# EAGLE design VSCard_v2 (EAGLE 8.3.1)
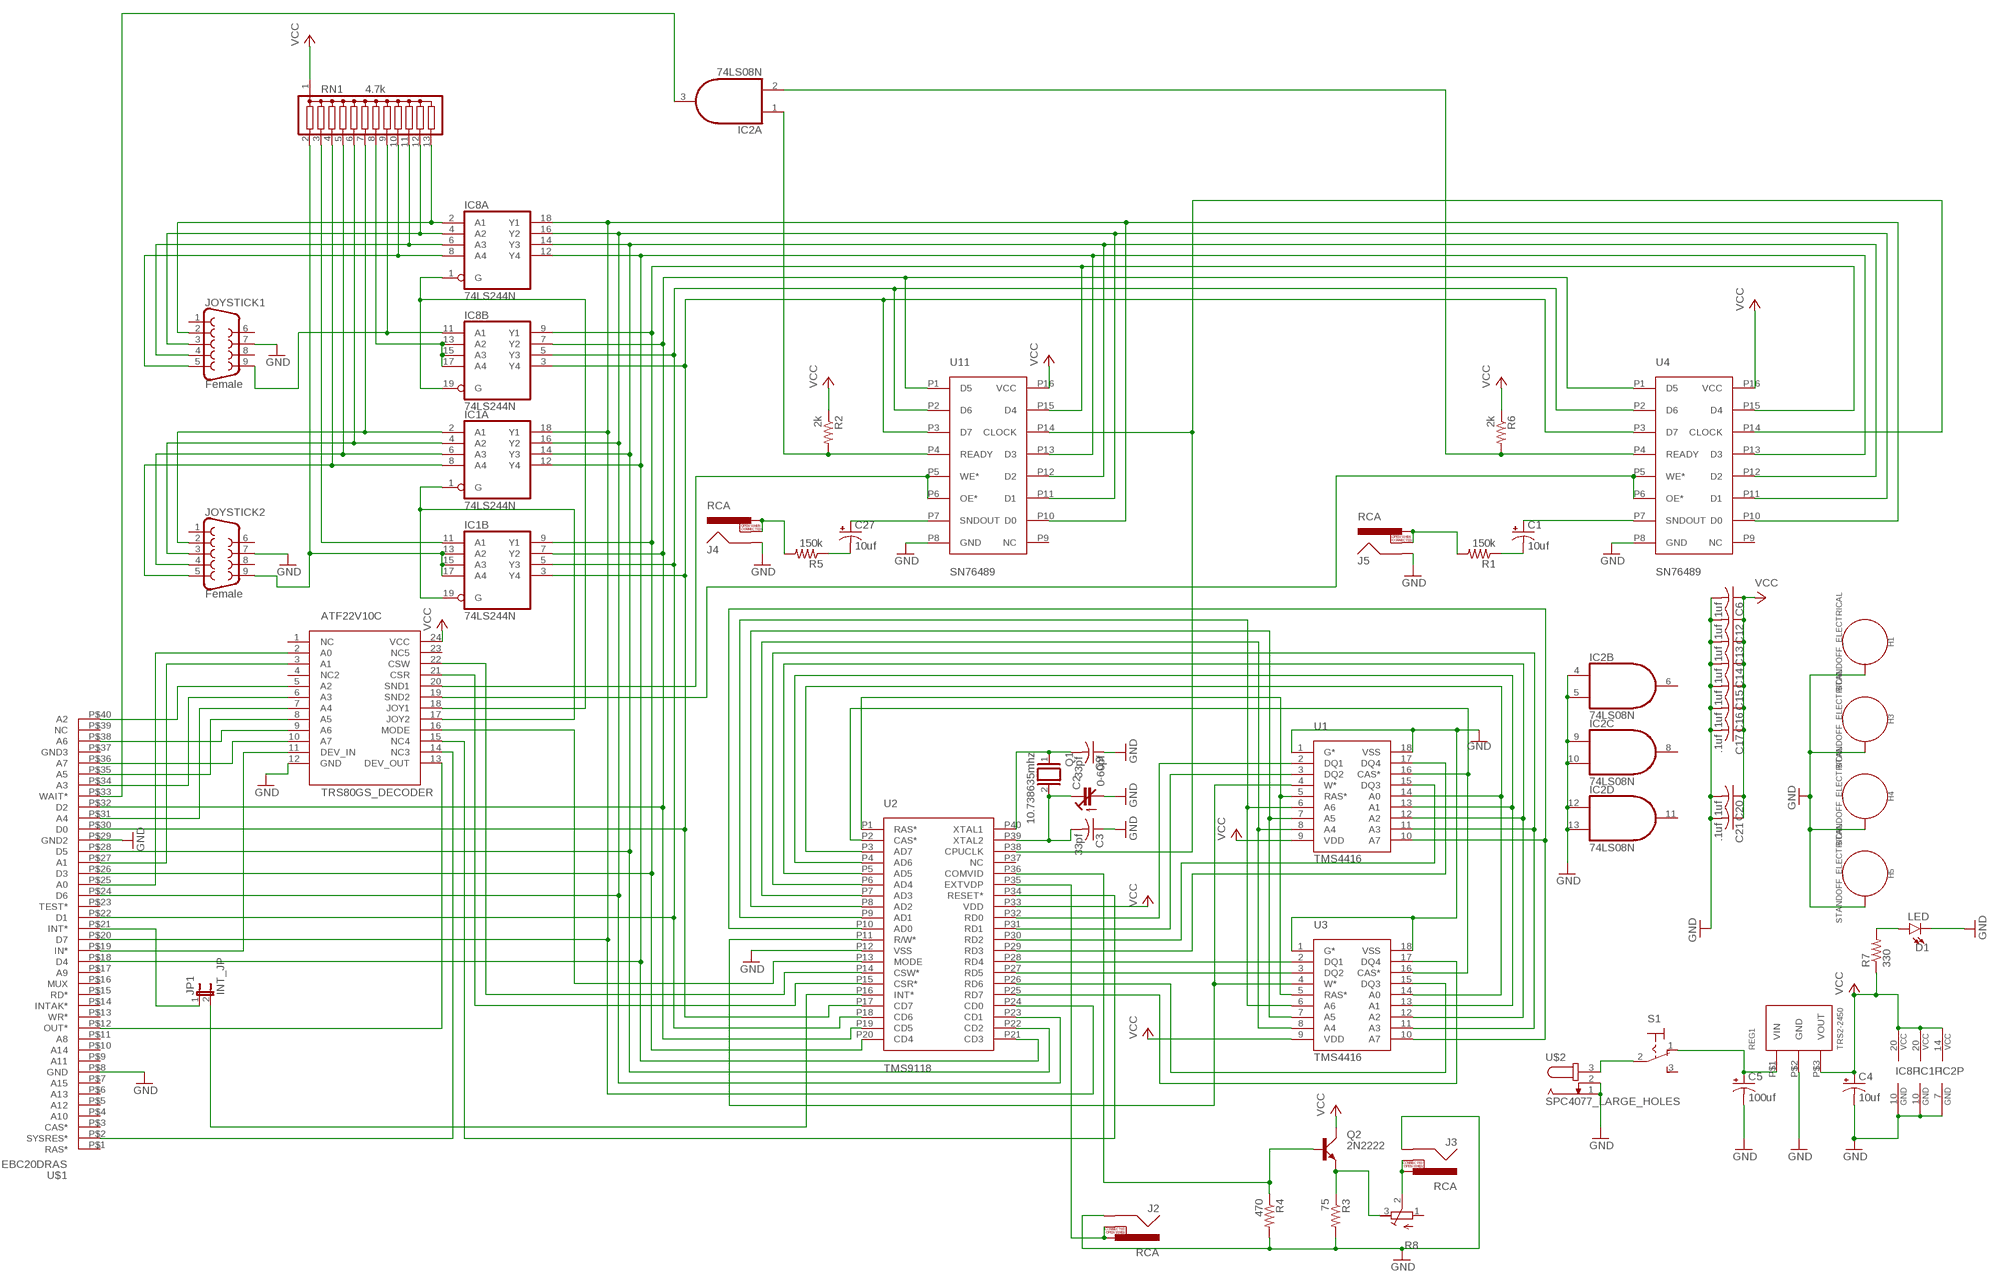
[diagram p0: schematic, sheet 1]

## Parts
ATF22V10C  TRS80GS_DECODER  [DIP24SKI]
C1  10uf  CPOL-USE2.5-6  [E2,5-6]
C2  0-60pf  C-TRIMM3050.504  [CTRIM3050.504]
C3  33pf  C-US050-050X075  [C050-050X075]
C4  10uf  CPOL-USE2.5-5  [E2,5-5]
C5  100uf  CPOL-USE3.5-10  [E3,5-10]
C6  .1uf  C-US025-025X050  [C025-025X050]
C9  33pf  C-US050-050X075  [C050-050X075]
C12  .1uf  C-US025-025X050  [C025-025X050]
C13  .1uf  C-US025-025X050  [C025-025X050]
C14  .1uf  C-US025-025X050  [C025-025X050]
C15  .1uf  C-US025-025X050  [C025-025X050]
C16  .1uf  C-US025-025X050  [C025-025X050]
C17  .1uf  C-US025-025X050  [C025-025X050]
C20  .1uf  C-US025-025X050  [C025-025X050]
C21  .1uf  C-US025-025X050  [C025-025X050]
C27  10uf  CPOL-USE2.5-6  [E2,5-6]
D1  LED  LED3MM  [LED_3MM]
H1  STANDOFF_ELECTRICAL  [STANDOFF-ELECTRICAL]
H3  STANDOFF_ELECTRICAL  [STANDOFF-ELECTRICAL]
H4  STANDOFF_ELECTRICAL  [STANDOFF-ELECTRICAL]
H5  STANDOFF_ELECTRICAL  [STANDOFF-ELECTRICAL]
IC1  74LS244N  [DIL20]
IC2  74LS08N  [DIL14]
IC8  74LS244N  [DIL20]
J2  RCA  [RCA]
J3  RCA  [RCA]
J4  RCA  [RCA]
J5  RCA  [RCA]
JOYSTICK1  Female  DB9FEMALE  [DB9]
JOYSTICK2  Female  DB9FEMALE  [DB9]
JP1  INT_JP  JP1E  [JP1]
Q1  10.738635mhz  XTAL/S  [QS]
Q2  2N2222  [TO18A]
R1  150k  R-US_0207/2V  [0207/2V]
R2  2k  R-US_0207/2V  [0207/2V]
R3  75  R-US_0207/2V  [0207/2V]
R4  470  R-US_0207/2V  [0207/2V]
R5  150k  R-US_0207/2V  [0207/2V]
R6  2k  R-US_0207/2V  [0207/2V]
R7  330  R-US_0309/V  [0309V]
R8  R-TRIMM64W  [RTRIM64W]
REG1  TRS2-2450  [TRACON_REG]
RN1  4.7k  G12R  [SIL13]
S1  320-916  [320-916]
U1  TMS4416  [DIP18]
U2  TMS9118  [DIP40_MCU]
U3  TMS4416  [DIP18]
U4  SN76489  [DIP16]
U11  SN76489  [DIP16]
U$1  EBC20DRAS  [EBC20DRAS]
U$2  SPC4077_LARGE_HOLES  [SPC4077]

## Nets
A0: ATF22V10C.2(A0) U$1.P$25(A0)
A1: ATF22V10C.3(A1) U$1.P$27(A1)
A2: ATF22V10C.5(A2) U$1.P$40(A2)
A3: ATF22V10C.6(A3) U$1.P$34(A3)
A4: ATF22V10C.7(A4) U$1.P$31(A4)
A5: ATF22V10C.8(A5) U$1.P$35(A5)
A6: ATF22V10C.9(A6) U$1.P$38(A6)
A7: ATF22V10C.10(A7) U$1.P$36(A7)
COMVID: Q2.B R4.1 U2.P36(COMVID)
COMVID-OUT: Q2.E R3.1 R8.3(E)
D0: IC1.3(B:Y4) IC8.3(B:Y4) U2.P17(CD7) U4.P3(D7) U11.P3(D7) U$1.P$30(D0)
D1: IC1.5(B:Y3) IC8.5(B:Y3) U2.P18(CD6) U4.P2(D6) U11.P2(D6) U$1.P$22(D1)
D2: IC1.7(B:Y2) IC8.7(B:Y2) U2.P19(CD5) U4.P1(D5) U11.P1(D5) U$1.P$32(D2)
D3: IC1.9(B:Y1) IC8.9(B:Y1) U2.P20(CD4) U4.P15(D4) U11.P15(D4) U$1.P$26(D3)
D4: IC1.12(A:Y4) IC8.12(A:Y4) U2.P21(CD3) U4.P13(D3) U11.P13(D3) U$1.P$18(D4)
D5: IC1.14(A:Y3) IC8.14(A:Y3) U2.P22(CD2) U4.P12(D2) U11.P12(D2) U$1.P$28(D5)
D6: IC1.16(A:Y2) IC8.16(A:Y2) U2.P23(CD1) U4.P11(D1) U11.P11(D1) U$1.P$24(D6)
D7: IC1.18(A:Y1) IC8.18(A:Y1) U2.P24(CD0) U4.P10(D0) U11.P10(D0) U$1.P$20(D7)
DOWN: IC8.4(A:A2) JOYSTICK1.3 RN1.12
DOWN1: IC1.4(A:A2) JOYSTICK2.3 RN1.6
GND: ATF22V10C.12(GND) C2.2(A) C3.1 C4.- C5.- C6.2 C9.1 C12.2 C13.2 C14.2 C15.2 C16.2 C17.2 C20.2 C21.2 D1.K(C) H1.P1 H3.P1 H4.P1 H5.P1 IC1.10(P:GND) IC2.4(B:I0) IC2.5(B:I1) IC2.7(P:GND) IC2.9(C:I0) IC2.10(C:I1) IC2.12(D:I0) IC2.13(D:I1) IC8.10(P:GND) J2.SHELL J3.SHELL J4.SHELL J5.SHELL JOYSTICK1.7 JOYSTICK2.7 R3.2 R4.2 REG1.P$2(GND) U1.1(G*) U1.18(VSS) U2.P12(VSS) U3.1(G*) U3.18(VSS) U4.P8(GND) U11.P8(GND) U$1.P$8(GND) U$1.P$29(GND2) U$2.1 U$2.2
IN*: ATF22V10C.11(DEV_IN) U$1.P$19(IN*)
INT*: JP1.1 U$1.P$21(INT*)
JOY1_IN_ENABLE_N: ATF22V10C.18(JOY1) IC8.1(A:G) IC8.19(B:G)
JOY1_IN_ENABLE_N1: ATF22V10C.17(JOY2) IC1.1(A:G) IC1.19(B:G)
LEFT: IC8.6(A:A3) JOYSTICK1.4 RN1.11
LEFT1: IC1.6(A:A3) JOYSTICK2.4 RN1.5
N$1: J4.PIN J4.SWITCH R5.2
N$2: S1.2(P) U$2.3
N$3: JP1.2 U2.P16(INT*)
N$4: J3.PIN J3.SWITCH R8.2(S)
N$11: IC1.13(B:A2) IC1.15(B:A3) IC1.17(B:A4) JOYSTICK2.9 RN1.2
N$14: ATF22V10C.22(CSW) U2.P14(CSW*)
N$15: ATF22V10C.21(CSR) U2.P15(CSR*)
N$16: C2.1(E) C3.2 Q1.2 U2.P39(XTAL2)
N$17: J2.PIN J2.SWITCH U2.P35(EXTVDP)
N$18: U1.5(RAS*) U2.P1(RAS*) U3.5(RAS*)
N$20: D1.A R7.2
N$21: U1.16(CAS*) U2.P2(CAS*) U3.16(CAS*)
N$24: J5.PIN J5.SWITCH R1.2
N$64: C27.- R5.1
N$94: C1.- R1.1
N$99: IC8.13(B:A2) IC8.15(B:A3) IC8.17(B:A4) RN1.8
OUT*: ATF22V10C.13(DEV_OUT) U$1.P$12(OUT*)
RIGHT: IC8.8(A:A4) JOYSTICK1.5 RN1.10
RIGHT1: IC1.8(A:A4) JOYSTICK2.5 RN1.4
SN76489-CLOCK: U2.P38(CPUCLK) U4.P14(CLOCK) U11.P14(CLOCK)
SND1_ENABLE_N: ATF22V10C.20(SND1) U11.P5(WE*) U11.P6(OE*)
SND1_READY: IC2.1(A:I0) R2.2 U11.P4(READY)
SND2_ENABLE_N: ATF22V10C.19(SND2) U4.P5(WE*) U4.P6(OE*)
SND2_READY: IC2.2(A:I1) R6.2 U4.P4(READY)
SNDOUT1: C27.+ U11.P7(SNDOUT)
SNDOUT2: C1.+ U4.P7(SNDOUT)
SYSRESET*: ATF22V10C.14(NC3) U$1.P$2(SYSRES*)
TMS9118_RW(*)_TMS4416_W(*): U1.4(W*) U2.P11(R/W*) U3.4(W*)
TMS9918_AD0-TMS4416_A7: U1.10(A7) U2.P10(AD0) U3.10(A7)
TMS9918_AD1-TMS4416_A6: U1.6(A6) U2.P9(AD1) U3.6(A6)
TMS9918_AD2-TMS4416_A5: U1.7(A5) U2.P8(AD2) U3.7(A5)
TMS9918_AD3-TMS4416_A4: U1.8(A4) U2.P7(AD3) U3.8(A4)
TMS9918_AD4-TMS4416_A3: U1.11(A3) U2.P6(AD4) U3.11(A3)
TMS9918_AD5-TMS4416_A2: U1.12(A2) U2.P5(AD5) U3.12(A2)
TMS9918_AD6-TMS4416_A1: U1.13(A1) U2.P4(AD6) U3.13(A1)
TMS9918_AD7-TMS4416_A0: U1.14(A0) U2.P3(AD7) U3.14(A0)
TRIGGER: IC8.11(B:A1) JOYSTICK1.9 RN1.9
TRIGGER1: IC1.11(B:A1) RN1.3
UP: IC8.2(A:A1) JOYSTICK1.2 RN1.13
UP1: IC1.2(A:A1) JOYSTICK2.2 RN1.7
VCC: ATF22V10C.24(VCC) C4.+ C6.1 C12.1 C13.1 C14.1 C15.1 C16.1 C17.1 C20.1 C21.1 IC1.20(P:VCC) IC2.14(P:VCC) IC8.20(P:VCC) Q2.C R2.1 R6.1 R7.1 REG1.P$3(VOUT) RN1.1 U1.9(VDD) U2.P33(VDD) U3.9(VDD) U4.P16(VCC) U11.P16(VCC)
VDP-RD0: U1.2(DQ1) U2.P32(RD0)
VDP-RD1: U1.3(DQ2) U2.P31(RD1)
VDP-RD2: U1.15(DQ3) U2.P30(RD2)
VDP-RD3: U1.17(DQ4) U2.P29(RD3)
VDP-RD4: U2.P28(RD4) U3.2(DQ1)
VDP-RD5: U2.P27(RD5) U3.3(DQ2)
VDP-RD6: U2.P26(RD6) U3.15(DQ3)
VDP-RD7: U2.P25(RD7) U3.17(DQ4)
VDP_MODE: ATF22V10C.16(MODE) U2.P13(MODE)
VID_RESET*: ATF22V10C.15(NC4) U2.P34(RESET*)
VOLTAGE-IN: C5.+ REG1.P$1(VIN) S1.1(O)
WAIT*: IC2.3(A:O) U$1.P$33(WAIT*)
XTAL1: C9.2 Q1.1 U2.P40(XTAL1)
Unconnected: ATF22V10C.1(NC) ATF22V10C.4(NC2) ATF22V10C.23(NC5) IC2.6(B:O) IC2.8(C:O) IC2.11(D:O) JOYSTICK1.1 JOYSTICK1.6 JOYSTICK1.8 JOYSTICK2.1 JOYSTICK2.6 JOYSTICK2.8 R8.1(A) S1.3(S) U2.P37(NC) U4.P9(NC) U11.P9(NC) U$1.P$1(RAS*) U$1.P$3(CAS*) U$1.P$4(A10) U$1.P$5(A12) U$1.P$6(A13) U$1.P$7(A15) U$1.P$9(A11) U$1.P$10(A14) U$1.P$11(A8) U$1.P$13(WR*) U$1.P$14(INTAK*) U$1.P$15(RD*) U$1.P$16(MUX) U$1.P$17(A9) U$1.P$23(TEST*) U$1.P$37(GND3) U$1.P$39(NC)

## Library data of the parts
ATF22V10C = TMS99:TRS80GS_DECODER
C1 C4 C27 = resistor:CPOL-US: POLARIZED CAPACITOR, American symbol
C2 = rcl:C-TRIMM: Trimm capacitor
C3 C9 = rcl:C-US: CAPACITOR, American symbol
C5 = rcl:CPOL-US: POLARIZED CAPACITOR, American symbol
C6 C12-C17 C20 C21 = resistor:C-US: CAPACITOR, American symbol
D1 = SparkFun-LED:LED: LED (Generic) Standard schematic elements and footprints for 5mm, 3mm, 1206, and 0603 sized LEDs. Generic LEDs with no color specified.; PROD_ID: DIO-08794
H1 H3-H5 = SparkFun-Hardware:STANDOFF_ELECTRICAL: Stand Off Drill holes with an electrical connection. For example, use these to ground your board to a chassis. Example SparkFun Products Screw - Phillips Head (1/4", 4-40, 10 pack) <https://www.sparkfun.com/products/10453> (PRT-10453) Screw - Phillips Head (1/2", 4-40, 10 pack) <https://www.sparkfun.com/products/10452> (PRT-10452) Screw - Phillips Head (3/4", 4-40, 10 pack) <https://www.sparkfun.com/products/10451> (PRT-10451) Screw - Phillips Head (1", 4-40, 10 pack) <https://www.sparkfun.com/products/10450> (PRT-10450)
IC1 IC8 = 74xx-us:74*244: Octal BUFFER and LINE DRIVER, 3-state
IC2 = 74xx-us:74*08: Quad 2-input AND gate
J2-J5 = SparkFun-Connectors:RCA: RCA Jack connector This is a right angle RCA jack connecotr. Commonly used for video or audio. Here is the connector we sell at SparkFun: RCA Jack <https://www.sparkfun.com/products/8631> (PRT-08631) Datasheet <http://www.sparkfun.com/datasheets/Prototyping/Connectors/RCA-Jack.pdf> It is not used on any active designs, however it was used on a couple retired products: RCA Jack Breakout [RETIRED] <https://www.sparkfun.com/products/8826> (PRT-08826) SparkFun On Screen Display Breakout - MAX7456 [RETIRED] <https://www.sparkfun.com/products/9168> (BOB-09168) You may also be interested in a cable: RCA Video Cable - 6' <https://www.sparkfun.com/products/11573> (CAB-11573); PROD_ID: CONN-09081; SF_ID: PRT-08631
JOYSTICK1 JOYSTICK2 = SparkFun-Connectors:DB9: DB9 Connector Standard DB9 (D-Sub 9) serial connector. Can be used for CAN bus as well as RS485 and RS232. Footprint production proven. Here is the female version connector we sell at SparkFun: 9 Pin Female Serial Connector - PCB Mount <https://www.sparkfun.com/products/429> (PRT-00429) This connector has been used on the following SparkFun products: SparkFun RS232 Shifter - SMD <https://www.sparkfun.com/products/449> (PRT-00449) SparkFun RS232 Shifter SMD (No DB9) <https://www.sparkfun.com/products/8780> (PRT-08780); PROD_ID: CONN-08194
JP1 = jumper:JP1E: JUMPER
Q1 = special:XTAL/S: CRYSTAL
Q2 = transistor-small-signal:2N2222: NPN TRANSISTOR
R1-R7 = resistor:R-US_: RESISTOR, American symbol
R8 = resistor:R-TRIMM: Trimm resistor
REG1 = TMS99:TRS2-2450: 5V TRACO regulator
RN1 = resistor-sil:G12R: SIL RESISTOR; OC_FARNELL: unknown; OC_NEWARK: unknown
S1 = switch:320-916: TOGGLE SWITCH distributor RS Components
U1 U3 = TMS99:TMS4416: TMS4416
U2 = TMS99:TMS9118: TMS9118
U4 U11 = TMS99:SN76489: SN76489 Sound Chip
U$1 = TMS99:EBC20DRAS
U$2 = con-jack:SPC4077_LARGE_HOLES

## Board
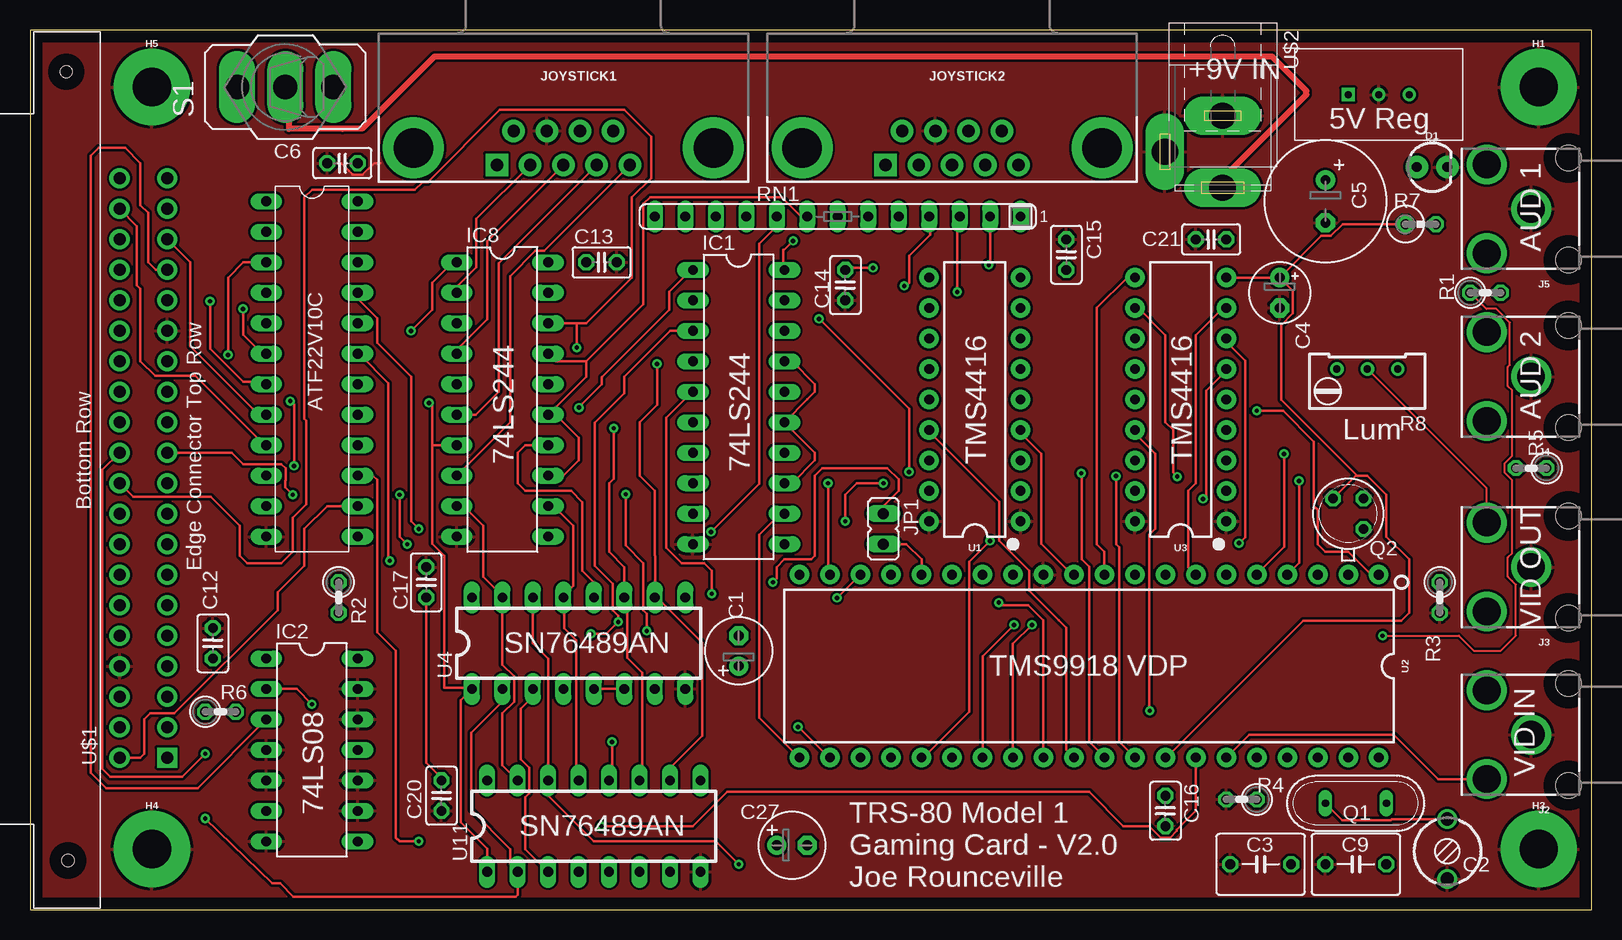
[diagram p1: board, top side]
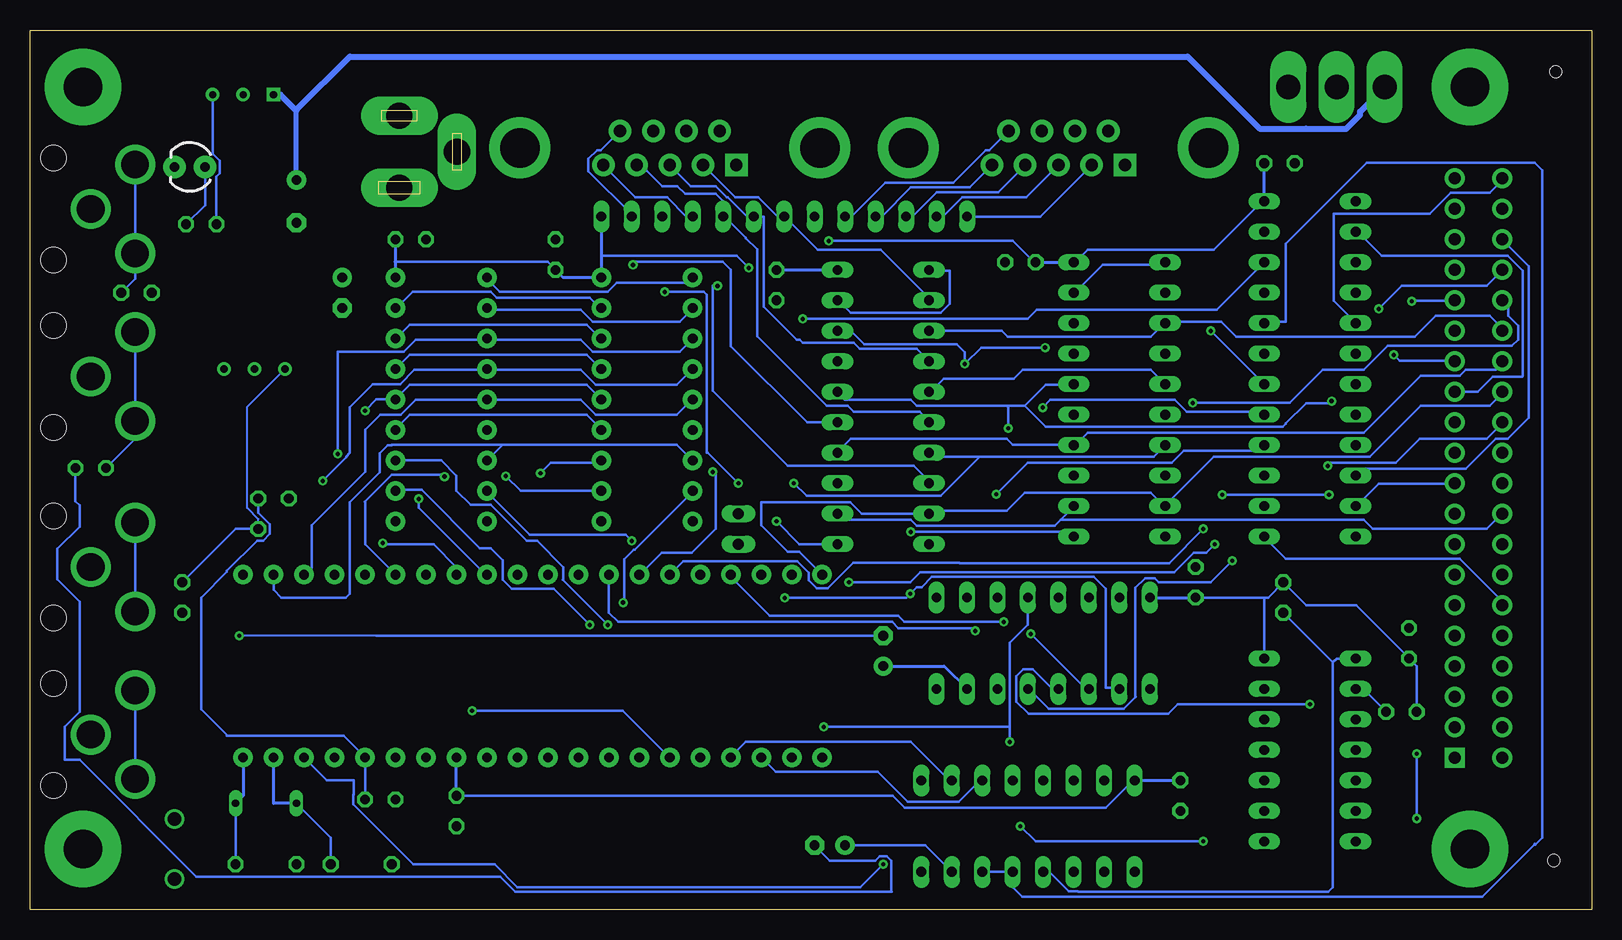
[diagram p2: board, bottom side, seen from below]

Size 130.16 x 73.33 mm. Coordinates in mm from the lower left corner, seen from the top.
Outline: 0,0 130.16,0 130.16,73.33 0,73.33 0,0
Copper layers (1*16): Top 0.035mm / dielectric 1.5mm / Bottom 0.035mm
Design rules "default": minimum track width 0.2mm, minimum drill 0.35mm, track to track 8mil, track to pad 8mil, pad to pad 8mil, via to via 8mil, smd to smd 8mil, copper to edge 40mil, drill to drill 6mil, minimum pad ring 10mil, minimum via ring 8mil, stop-mask expansion 4mil, vias tented up to drill 0mil, thermal gap 10mil

### Footprints (pad centres in the part's own frame; a part is rotated, then mirrored left to right if it is on the bottom)
DIP24SKI = drill 0.813 pad 1.27 long: 1 -11.43,-3.81; 2 -8.89,-3.81; 3 -6.35,-3.81; 4 -3.81,-3.81; 5 -1.27,-3.81; 6 1.27,-3.81; 7 3.81,-3.81; 8 6.35,-3.81; 9 8.89,-3.81; 10 11.43,-3.81; 11 13.97,-3.81; 12 16.51,-3.81; 13 16.51,3.81; 14 13.97,3.81; 15 11.43,3.81; 16 8.89,3.81; 17 6.35,3.81; 18 3.81,3.81; 19 1.27,3.81; 20 -1.27,3.81; 21 -3.81,3.81; 22 -6.35,3.81; 23 -8.89,3.81; 24 -11.43,3.81
E2,5-6 = drill 0.813 pad 1.6: + -1.27,0 | drill 0.813 pad 1.6 octagon: - 1.27,0
CTRIM3050.504 = drill 1.1: 1 -2.5,0; 2 2.5,0
C050-050X075 = drill 0.813 octagon: 1 -2.54,0; 2 2.54,0
E2,5-5 = drill 0.813 pad 1.6: + -1.27,0 | drill 0.813 pad 1.6 octagon: - 1.27,0
E3,5-10 = drill 0.813 pad 1.6: + -1.778,0 | drill 0.813 pad 1.6 octagon: - 1.778,0
C025-025X050 = drill 0.813 octagon: 1 -1.27,0; 2 1.27,0
LED_3MM = drill 0.813 pad 1.88: A -1.27,0; K 1.27,0
STANDOFF-ELECTRICAL = drill 3.2 pad 6.35: P1 0,0
DIL20 = drill 0.813 long: 1 -11.43,-3.81; 2 -8.89,-3.81; 3 -6.35,-3.81; 4 -3.81,-3.81; 5 -1.27,-3.81; 6 1.27,-3.81; 7 3.81,-3.81; 8 6.35,-3.81; 9 8.89,-3.81; 10 11.43,-3.81; 11 11.43,3.81; 12 8.89,3.81; 13 6.35,3.81; 14 3.81,3.81; 15 1.27,3.81; 16 -1.27,3.81; 17 -3.81,3.81; 18 -6.35,3.81; 19 -8.89,3.81; 20 -11.43,3.81
DIL14 = drill 0.813 long: 1 -7.62,-3.81; 2 -5.08,-3.81; 3 -2.54,-3.81; 4 0,-3.81; 5 2.54,-3.81; 6 5.08,-3.81; 7 7.62,-3.81; 8 7.62,3.81; 9 5.08,3.81; 10 2.54,3.81; 11 0,3.81; 12 -2.54,3.81; 13 -5.08,3.81; 14 -7.62,3.81
RCA = drill 2.3: PIN 3.7,3.7; SHELL 0,0; SWITCH 3.7,-3.7 | hole 2.1: -3.1,4.25; -3.1,-4.25
DB9 = drill 1.016 pad 1.88 square: 1 -5.54,-1.42 | drill 1.016 pad 1.88: 2 -2.77,-1.42; 3 0,-1.42; 4 2.77,-1.42; 5 5.54,-1.42; 6 -4.15,1.42; 7 -1.38,1.42; 8 1.38,1.42; 9 4.15,1.42 | drill 3.302 pad 5.08: G1 -12.5,0; G2 12.5,0
JP1 = drill 0.914 long: 1 0,-1.27; 2 0,1.27
QS = drill 0.61 long: 1 -2.54,0; 2 2.54,0
TO18A = drill 0.813 octagon: B 1.27,-1.27; C 1.27,1.27; E -1.27,-1.27
0207/2V = drill 0.813 octagon: 1 -1.27,0; 2 1.27,0
0309V = drill 0.813 octagon: 1 -1.27,0; 2 1.27,0
RTRIM64W = drill 0.61: 1 1.27,-2.54; 2 1.27,0; 3 1.27,2.54
TRACON_REG = drill 0.6 square: P$1 0,0 | drill 0.6: P$2 2.54,0; P$3 5.08,0
SIL13 = drill 0.813 long: 1 -15.24,0; 2 -12.7,0; 3 -10.16,0; 4 -7.62,0; 5 -5.08,0; 6 -2.54,0; 7 0,0; 8 2.54,0; 9 5.08,0; 10 7.62,0; 11 10.16,0; 12 12.7,0; 13 15.24,0
320-916 = drill 2.007 long: 1 0,4.013; 2 0,0; 3 0,-4.013
DIP18 = drill 0.813 pad 1.626: 1 -10.16,-3.81; 2 -7.62,-3.81; 3 -5.08,-3.81; 4 -2.54,-3.81; 5 0,-3.81; 6 2.54,-3.81; 7 5.08,-3.81; 8 7.62,-3.81; 9 10.16,-3.81; 10 10.16,3.81; 11 7.62,3.81; 12 5.08,3.81; 13 2.54,3.81; 14 0,3.81; 15 -2.54,3.81; 16 -5.08,3.81; 17 -7.62,3.81; 18 -10.16,3.81
DIP40_MCU = drill 0.813 pad 1.626: P1 -24.13,-7.62; P2 -21.59,-7.62; P3 -19.05,-7.62; P4 -16.51,-7.62; P5 -13.97,-7.62; P6 -11.43,-7.62; P7 -8.89,-7.62; P8 -6.35,-7.62; P9 -3.81,-7.62; P10 -1.27,-7.62; P11 1.27,-7.62; P12 3.81,-7.62; P13 6.35,-7.62; P14 8.89,-7.62; P15 11.43,-7.62; P16 13.97,-7.62; P17 16.51,-7.62; P18 19.05,-7.62; P19 21.59,-7.62; P20 24.13,-7.62; P21 24.13,7.62; P22 21.59,7.62; P23 19.05,7.62; P24 16.51,7.62; P25 13.97,7.62; P26 11.43,7.62; P27 8.89,7.62; P28 6.35,7.62; P29 3.81,7.62; P30 1.27,7.62; P31 -1.27,7.62; P32 -3.81,7.62; P33 -6.35,7.62; P34 -8.89,7.62; P35 -11.43,7.62; P36 -13.97,7.62; P37 -16.51,7.62; P38 -19.05,7.62; P39 -21.59,7.62; P40 -24.13,7.62
DIP16 = drill 0.813 long: P1 -8.89,-3.81; P2 -6.35,-3.81; P3 -3.81,-3.81; P4 -1.27,-3.81; P5 1.27,-3.81; P6 3.81,-3.81; P7 6.35,-3.81; P8 8.89,-3.81; P9 8.89,3.81; P10 6.35,3.81; P11 3.81,3.81; P12 1.27,3.81; P13 -1.27,3.81; P14 -3.81,3.81; P15 -6.35,3.81; P16 -8.89,3.81
EBC20DRAS = drill 1 pad 1.676 square: P$1 0,0 | drill 1 pad 1.676: P$2 0,3.969; P$3 2.54,0; P$4 2.54,3.969; P$5 5.08,0; P$6 5.08,3.969; P$7 7.62,0; P$8 7.62,3.969; P$9 10.16,0; P$10 10.16,3.969; P$11 12.7,0; P$12 12.7,3.969; P$13 15.24,0; P$14 15.24,3.969; P$15 17.78,0; P$16 17.78,3.969; P$17 20.32,0; P$18 20.32,3.969; P$19 22.86,0; P$20 22.86,3.969; P$21 25.4,0; P$22 25.4,3.969; P$23 27.94,0; P$24 27.94,3.969; P$25 30.48,0; P$26 30.48,3.969; P$27 33.02,0; P$28 33.02,3.969; P$29 35.56,0; P$30 35.56,3.969; P$31 38.1,0; P$32 38.1,3.969; P$33 40.64,0; P$34 40.64,3.969; P$35 43.18,0; P$36 43.18,3.969; P$37 45.72,0; P$38 45.72,3.969; P$39 48.26,0; P$40 48.26,3.969 | hole 1: -8.572,8.255; 57.15,8.414
SPC4077 = drill 2.184 pad 2.184 long: 1 -3,0; 2 0,-4.8; 3 3,0

### Placement (x,y rotation side)
ATF22V10C  23.5,47.62 270 top
C1  59.05,21.59 90 top
C2  118.11,5.08 270 top
C3  102.55,3.81 0 top
C4  104.14,51.44 270 top
C5  107.95,59.05 270 top
C6  26.04,62.23 180 top
C9  110.49,3.81 0 top
C12  15.24,22.23 90 top
C13  47.62,53.98 0 top
C14  67.94,52.07 270 top
C15  86.36,54.61 90 top
C16  94.61,8.26 270 top
C17  33.02,27.3 90 top
C20  34.29,9.53 270 top
C21  98.42,55.88 180 top
C27  63.5,5.4 0 top
D1  116.84,61.91 0 top
H1  125.73,68.58 0 top
H3  125.73,5.08 0 top
H4  10.16,5.08 0 top
H5  10.16,68.58 0 top
IC1  59.05,41.91 270 top
IC2  23.5,13.34 270 top
IC8  39.37,42.55 270 top
J2  125.09,14.61 180 top
J3  125.09,28.57 180 top
J4  125.09,44.45 180 top
J5  125.09,58.42 180 top
JOYSTICK1  44.45,63.5 0 top
JOYSTICK2  76.83,63.5 0 top
JP1  71.12,31.75 180 top
Q1  110.49,8.89 180 top
Q2  109.86,33.02 90 top
R1  121.28,51.44 0 top
R2  25.72,26.04 270 top
R3  117.47,26.04 270 top
R4  100.97,9.21 180 top
R5  125.09,36.83 180 top
R6  15.88,16.51 0 top
R7  115.89,57.15 0 top
R8  111.44,43.81 90 top
REG1  109.86,67.94 0 top
RN1  67.31,57.78 180 top
S1  21.27,68.58 90 top
U1  78.74,42.55 90 top
U2  88.27,20.32 180 top
U3  95.89,42.55 90 top
U4  45.72,22.23 0 top
U11  46.99,6.99 0 top
U$1  11.43,12.7 90 top
U$2  99.38,63.18 270 top

### Tracks (layer width: path | path; a pad name or v marks a point on that pad's centre or on a via)
A0
  Bottom 0.2: ATF22V10C.2 19.5,56.5 17.5,54.5 7,54.5 5.75,53.25 5.75,44.5 5.8,44.45 8.26,44.45 9.53,43.18 U$1.P$25
A1  (via drill 0.35)
  Top 0.2: ATF22V10C.3 17.78,53.98 16.5,52.7 v16.5,46.25
  Bottom 0.2: v16.5,46.25 16,45.75 11.5,45.75 U$1.P$27
A2
  Bottom 0.2: ATF22V10C.5 19.75,49 21.5,50.75 21.5,58 13.5,58 11.75,59.75 8.5,59.75 7.5,60.75 U$1.P$40
A3  (via drill 0.35)
  Top 0.2: ATF22V10C.6 19.37,46.35 17.78,47.94 17.78,50.06 v17.75,50.09
  Bottom 0.2: U$1.P$34 7.5,53.25 8.75,52 15.84,52 v17.75,50.09
A4  (via drill 0.35)
  Top 0.2: v15,50.72 15,46.75 17.75,44 19.5,44 ATF22V10C.7
  Bottom 0.2: U$1.P$31 11.5,50.75 14.97,50.75 v15,50.72
A5
  Top 0.2: ATF22V10C.8 19.05,41.27 13.34,46.99 13.34,53.98 U$1.P$35
A6
  Top 0.2: ATF22V10C.9 19.5,38.75 13.75,44.5 10.43,44.5 9.21,45.72 9.21,51.75 8.89,52.07 8.89,56.99 U$1.P$38
A7
  Bottom 0.2: ATF22V10C.10 19.5,36.25 19,36.75 10.5,36.75 8,39.25 7,39.25 5.25,41 5.25,53.63 7.46,55.84 U$1.P$36
COMVID
  Bottom 0.2: 113.67,14.5 104,14.5 102.25,12.75 U2.P36 R4.1 | 113.67,14.5 113.75,14.5 | Q2.B 111.12,33.11 110.16,32.15 110.16,31.35 110.73,30.79 111.21,30.79 113.75,28.25 113.75,28.17 115.89,26.04 115.89,16.71 113.67,14.5
COMVID-OUT
  Bottom 0.152: Q2.E 111.12,32.58 112.06,33.52 112.06,41.92 R8.3
  Bottom 0.2: Q2.E 113.03,31.75 R3.1
D0  (via drill 0.35)
  Top 0.2: IC1.3 53.34,48.26 49.53,44.45 49.53,43.07 47.05,40.58 47.05,28.7 48.57,27.18 48.57,24.98 49.02,24.52 v49.02,24 48.02,23 v46.75,23 | U4.P3 41.91,17.78 40.9,16.77 40.9,12.55 41.6,11.86 41.6,9.73 41.27,9.41 41.27,5.08 U11.P3
  Bottom 0.2: IC1.3 55,48.25 49.2,48.25 48.7,47.75 36.75,47.75 35.75,48.75 IC8.3 35.5,49 30.86,49 29.61,47.75 14.75,47.75 13,49.5 8.5,49.5 7.5,48.5 U$1.P$30 | v49.02,24 57.29,24 57.79,24.5 68.5,24.5 71.75,27.75 U2.P17 | v46.75,23 42.25,18.5 42,18.5 U4.P3
D1  (via drill 0.35)
  Top 0.2: 40.5,3.25 U11.P2 | U4.P2 39.25,18.25 39.25,17.25 36.75,14.75 36.75,8.34 40.01,5.08 40.01,3.81 U11.P2 | v67.25,26 69,27.75 U2.P18 | IC1.5 55,43 53,41 53,30.18 54.29,28.89 56.17,28.89 56.81,28.25 v56.81,26.34 | v14.61,7.62 20.2,2.22 20.84,2.22 21.94,1.12 40.49,1.12 40.64,1.27 U11.P2 | U$1.P$22 6.03,36.67 6.03,11.75 6.67,11.11 12.7,11.11 v14.61,13.02
  Bottom 0.2: IC8.5 35.75,44 36.75,45 47.42,45 48.17,44.25 54,44.25 55,43.25 IC1.5 | U4.P2 39.5,18.5 40.5,18.5 40.5,26.75 41.5,27.75 55,27.75 55.85,26.9 56.25,26.9 v56.81,26.34 57.16,26 v67.25,26 | U11.P2 40.5,3.25 | v14.61,13.02 v14.61,7.62
D2  (via drill 0.35)
  Top 0.2: v66.5,35.56 66.5,28 U2.P19 | v33.25,42.25 33.5,42 33.5,38.74 | 33.5,38.74 33.5,30.5 34.5,29.5 34.5,18.5 36.75,18.5 U4.P1 35.88,17.46 35.88,7.3 38.1,5.08 U11.P1 | U11.P1 | IC8.7 33.5,38.73 33.5,38.74
  Bottom 0.2: 51,37.75 54.75,37.75 55,38 IC1.7 | 51,37.75 36.5,37.75 35.75,38.5 IC8.7 | 51,37.75 54.25,34.5 65.44,34.5 v66.5,35.56 | v33.25,42.25 25.16,42.25 22.41,45 19,45 17,47 6.66,47 6.15,47.5 6.15,48.7 6.99,49.53 6.99,50.32 U$1.P$32
D3
  Top 0.2: IC8.9 35.75,33.5 36.25,33.5 37.75,32 37.75,27.75 39.25,26.25 U4.P15 39.37,20.44 40.33,19.48 40.33,17.36 39.37,16.39 39.37,12.06 U11.P15
  Bottom 0.2: IC1.9 55,33.25 48.75,33.25 47.25,34.75 36.75,34.75 35.75,33.75 IC8.9 35.5,33.75 31.5,37.75 18.5,37.75 14.25,42 8.5,42 7.5,43 U$1.P$26 | 55.25,33.25 IC1.9 | IC1.9 60.84,33.02 61.8,33.98 63.92,33.98 63.94,33.97 69.22,33.97 69.22,32.07 66.99,29.84 66.04,29.84 U2.P20
D4
  Top 0.2: IC8.12 43.25,33.5 43.75,33.5 45.25,32 45.25,27 44.5,26.25 U4.P13 44.5,26 44.5,23.48 45.5,22.48 45.5,11 U11.P13 | U2.P21 64,12.75 60.75,16 60.75,31.25 62.75,33.25 IC1.12
  Bottom 0.2: 44.25,32.5 43.25,33.5 IC8.12 | 44.25,32.5 44.75,32 56.25,32 56.75,32.5 62.25,32.5 62.75,33 IC1.12 | 44.25,32.5 19,32.5 18.25,31.75 8.75,31.75 7.5,33 U$1.P$18
D5  (via drill 0.35)
  Top 0.2: v48.5,14 48.5,11 U11.P12 | v64,15.25 66.5,12.75 U2.P22 | IC8.14 41.27,38.73 40.64,38.1 40.64,35.56 41.27,34.92 45.09,34.92 46.04,33.97 46.04,28.26 46.99,27.3 U4.P12
  Bottom 0.2: v48.5,14 48.5,15.25 | 48.5,15.25 48.5,22.25 47,23.75 47,26 U4.P12 | 48.5,15.25 v64,15.25 | IC1.14 62.75,38.25 61.75,39.25 48.75,39.25 48.25,38.75 43.25,38.75 IC8.14 43,38.75 42,39.75 19,39.75 14.25,44.5 11,44.5 10.5,45 8,45 7.5,45.5 U$1.P$28
D6  (via drill 0.35)
  Top 0.2: U11.P11 51,11 51,19.75 49.75,21 49.75,26 U4.P11 49.53,28.57 48.26,29.84 48.26,35.56 48.63,35.94 v48.63,40.13 | v22,37 22,42.09 v21.69,42.41
  Bottom 0.2: U11.P11 51,10.75 52.75,9 57,9 59.5,11.5 68,11.5 69,12.5 U2.P23 | 48.73,42 47.25,42 | 48.73,42 56.25,42 56.75,42.5 62.25,42.5 62.75,43 IC1.16 | 47.25,42 45.5,43.75 43.25,43.75 IC8.16 | v22,37 21.75,37.25 16.34,37.25 14.35,39.25 8.75,39.25 7.5,40.5 U$1.P$24 | 47.25,42 45.5,40.25 25.75,40.25 25.5,40.5 25.5,40.54 23.81,42.23 21.87,42.23 v21.69,42.41 | v48.63,40.13 48.63,41.9 48.73,42
D7  (via drill 0.35)
  Top 0.2: U11.P10 53.5,11 53.5,12 56,14.5 56,22.25 52.25,26 U4.P10 52.13,26.11 | 52.13,26.11 52.25,26.25 | v52.25,45.5 52.25,42.09 50.8,40.64 50.8,36.2 52.07,34.92 52.07,29.54 52.12,29.49 52.12,26.13 52.13,26.11 | 45.56,48.9 46.35,48.9 50.16,52.7 50.16,59.37 51.75,60.96 51.75,64.45 49.53,66.67 39.15,66.67 33.13,60.66 32.72,60.66 32.07,60.01 28.38,60.01 28.36,60.02 23.51,60.02 22.86,59.37 22.86,40.93 23.01,40.78 23.01,33.8 21.91,32.7 21.91,29.84 20.95,28.89 18.1,28.89 17.46,29.53 17.46,32.03 15.08,34.42 8.6,34.42 U$1.P$20 | 45.56,48.9 IC8.18 | v45.57,46.87 45.57,48.89 45.56,48.9
  Bottom 0.2: IC1.18 62.75,48.25 61.75,48.25 60.65,47.15 52.91,47.15 52.25,46.49 v52.25,45.5 50.88,46.87 v45.57,46.87 | U2.P24 71.75,12.75 70.5,14 56.75,14 53.75,11 53.5,11 U11.P10
DOWN
  Top 0.2: IC8.4 35.56,46.67 38.1,49.21 38.1,55.73 JOYSTICK1.3
  Bottom 0.2: RN1.12 54.09,57.78 52.47,59.41 47.12,59.41 JOYSTICK1.3
DOWN1
  Bottom 0.2: IC1.4 55.25,45.75 56.25,46.75 61,46.75 61.5,47.25 65.77,47.25 66.02,47.5 66.25,47.5 69,50.25 69,57.75 69.75,57.75 RN1.6 70.37,57.78 71.99,59.41 72.11,59.41 73.03,60.33 75.08,60.33 JOYSTICK2.3
GND
  Top 0.2: C6.2 25.94,62.23 26.91,61.27 27.7,61.27 28.67,62.23 29.2,62.23
  pour Top: 0,0 130.18,0 130.18,73.66 0,73.66
IN*
  Bottom 0.2: ATF22V10C.11 19.5,33.75 17.75,35.5 11.5,35.5 U$1.P$19
INT*  (via drill 0.35)
  Top 0.2: JP1.1 71.12,33.66 72.39,34.92 72.39,35.88 71.44,36.83 66.04,36.83 65.41,36.2 65.41,29.53 65.09,29.21 62.87,29.21 62.23,28.57 62.23,27.62 v61.91,27.3 | v31.43,30.48 30.8,31.11 v30.8,34.61 | v21.91,34.61 21.27,35.24 21.27,35.76 21.31,35.8 21.31,36.79 20.95,37.15 20.76,37.15 20.75,37.16 17.77,37.16 16.83,38.1 U$1.P$21
  Bottom 0.2: v31.43,30.48 32.14,29.78 33.18,29.78 34.8,28.15 55.97,28.15 56.81,27.3 v61.91,27.3 | v30.8,34.61 28.38,34.61 28.36,34.62 26.25,34.62 26.23,34.61 v21.91,34.61
JOY1_IN_ENABLE_N  (via drill 0.35)
  Top 0.2: v31.75,48.25 33.5,50 33.5,52.25 35,53.75 35.5,53.75 IC8.1
  Bottom 0.2: v31.75,48.25 27.5,44 ATF22V10C.18 | IC8.19 43,51.5 40.75,53.75 35.75,53.75 IC8.1
JOY1_IN_ENABLE_N1  (via drill 0.35)
  Top 0.2: IC1.1 55,53.25 53.25,51.5 53.25,50 47.69,44.44 47.62,44.38 47.62,43.81 45.75,41.94 v45.75,41.87
  Bottom 0.2: ATF22V10C.17 27.5,41.5 33.75,41.5 34.75,42.5 45.12,42.5 v45.75,41.87 | IC1.19 62.75,50.75 61.75,49.75 54.25,49.75 53.5,50.5 53.5,53.25 55,53.25 IC1.1
LEFT
  Top 0.2: IC8.6 37.15,41.27 39.05,43.18 39.05,53.91 JOYSTICK1.4
  Bottom 0.2: RN1.11 56.63,57.78 54.61,59.81 49.49,59.81 JOYSTICK1.4
LEFT1
  Bottom 0.2: IC1.6 55.25,40.75 56,41.5 61.5,41.5 62,42 63.75,42 69.57,47.82 69.57,55.05 70.5,55.98 70.5,56 72.25,57.75 RN1.5 72.39,59.05 73.03,59.69 75.56,59.69 76.2,60.33 77.47,60.33 78.74,61.59 79.12,61.59 JOYSTICK2.4
N$1
  Bottom 0.2: J4.SWITCH J4.PIN 121.39,39.26 R5.2
N$2
  Top 0.508: U$2.3 99.38,60.96 106.36,67.94 106.36,68.26 103.5,71.12 33.69,71.12 27.69,65.11 26.06,65.11 26.04,65.09 21.59,65.09 21.59,68.26 S1.2
N$3
  Top 0.2: U2.P16 74.3,29.21 73.03,30.48 JP1.2
N$4
  Top 0.152: J3.SWITCH 121.39,35.13 R8.2
  Bottom 0.2: J3.SWITCH J3.PIN
N$11  (via drill 0.35)
  Top 0.2: 63,40.5 IC1.15 | 62.93,40.7 63,40.75 | 62.93,40.7 IC1.15 | 80,57.75 RN1.2 80.01,53.85 v79.91,53.75 | IC1.17 63.5,45.72 65.41,43.81 65.41,43.18 64.78,42.56 64.78,42.55 62.93,40.7 | IC1.15 65.41,38.1 65.41,37.47 63.5,35.56 IC1.13
  Bottom 0.2: IC1.15 65.41,40.64 71.75,46.99 71.75,53.34 72.42,54 79.66,54 v79.91,53.75 | RN1.2 80.01,57.96 83.62,61.56 83.62,62.59 82.89,63.32 82.58,63.32 JOYSTICK2.9
N$14  (via drill 0.35)
  Top 0.2: v65.75,49.25 73.25,41.75 v73.25,36.5
  Bottom 0.2: v65.75,49.25 47.02,49.25 46.27,50 31.25,50 27.5,53.75 ATF22V10C.22 | U2.P14 79.25,28 77.5,29.75 75.03,29.75 73.03,31.75 73.03,36.27 v73.25,36.5
N$15  (via drill 0.35)
  Top 0.2: 27.5,51.25 ATF22V10C.21 27.3,50.92 28.93,49.29 28.93,47.27 31.75,44.45 31.75,32.38 v32.38,31.75
  Bottom 0.2: v32.38,31.75 35.23,28.9 52.69,28.9 52.72,28.93 61.56,28.93 63.67,26.82 64.6,26.82 65.25,27.48 65.25,28.09 66.21,29.06 75.72,29.06 U2.P15
N$16
  Top 0.2: C2.1 113.5,7.58 113.39,7.47 109.37,7.47 Q1.2
  Bottom 0.2: C3.2 105.09,6.03 Q1.2
  Bottom 0.254: U2.P39 109.86,8.9 109.85,8.89 Q1.2
N$17
  Top 0.2: J2.PIN 117.36,10.9 113.67,14.61 101.6,14.61 U2.P35
  Bottom 0.2: J2.SWITCH J2.PIN
N$18  (via drill 0.35)
  Top 0.2: U2.P1 111.76,27.94 109.86,29.84 107.95,29.84 107.31,30.48 107.31,33.34 107,33.66 107,39.04 104.44,41.59 v102.23,41.59
  Bottom 0.2: U1.5 82.75,42.75 83.75,43.75 98.5,43.75 99.5,42.75 U3.5 | U3.5 99.75,42.5 99.8,42.55 | U3.5 101.28,42.55 v102.23,41.59
N$20
  Bottom 0.2: D1.A 115.57,58.74 R7.2
N$21
  Bottom 0.2: 90.75,38.75 76.25,38.75 75,37.5 U1.16 | 90.75,38.75 92,37.5 U3.16 | 90.75,38.75 100,38.75 100.02,38.73 100.33,38.73 101,38.06 101,36.48 103.5,33.97 103.5,26.35 103.82,26.04 109.22,26.04 109.86,26.67 U2.P2
N$24
  Bottom 0.2: J5.SWITCH J5.PIN 121.39,52.59 R1.2
N$64
  Bottom 0.2: 116.25,2.75 116.28,2.78 | 116.28,2.78 126,12.5 127.25,12.5 127.25,15.25 126,16.5 126,25.7 127.88,27.57 127.88,30.08 126.03,31.93 126.03,33.72 126.36,34.06 R5.1 | 64.77,5.36 64.77,5.23 | 64.77,5.36 C27.- | 116.28,2.78 90.98,2.78 89.7,1.5 58.33,1.5 58.37,1.54 58.37,4.09 58.77,4.49 59.34,4.49 59.74,4.09 63.5,4.09 64.77,5.36
N$94  (via drill 0.35)
  Top 0.152: 123.44,27.5 123.51,27.42 | 123.44,27.5 123.16,27.77 123.16,29.38 123.51,29.73 123.51,35.82 122.89,36.44 122.89,37.22 123.51,37.84 123.51,43.3 123.16,43.65 123.16,45.25 123.33,45.43 123.33,48.95 122.2,50.09 121.36,50.09 R1.1 | v112.71,22.86 119.06,22.86 120.33,21.59 122.56,21.59 123.83,22.86 123.83,27.11 123.44,27.5
  Bottom 0.152: 101.28,22.86 v112.71,22.86
  Bottom 0.2: 59.25,23 C1.- 101.28,22.86
N$99
  Top 0.2: RN1.8 64.25,57.78 62.63,59.41 51.67,59.41 51.11,58.84 51.11,50.47 46.35,45.72 | IC8.13 44.45,36.2 45.72,37.47 45.72,39.37 43.81,41.27 IC8.15 46.35,44.45 46.35,45.72 | 46.35,45.72 43.81,45.72 IC8.17
OUT*
  Bottom 0.2: ATF22V10C.13 27.25,31 25.5,29.25 11,29.25 7.25,25.5 U$1.P$12
RIGHT
  Top 0.2: JOYSTICK1.5 42.85,54.94 42.12,54.94 40.01,52.82 40.01,40.64 IC8.8 35.56,36.71
  Bottom 0.2: JOYSTICK1.5 51.85,60.22 56.74,60.22 59.17,57.78 RN1.10
RIGHT1  (via drill 0.35)
  Top 0.2: RN1.4 75,57.75 75,56.25 73.25,54.5 73.25,52.25 73,52 v72.86,52
  Bottom 0.2: 73.25,51.98 73.25,52 | 73.25,51.98 73.25,43.25 67,37 56.5,37 55.25,35.75 IC1.8 | v72.86,52 73.22,52 73.25,51.98 | JOYSTICK2.5 79.7,59.41 77.07,59.41 75.45,57.78 RN1.4
SN76489-CLOCK  (via drill 0.35)
  Top 0.2: v59.05,3.81 57.15,5.71 46.99,5.71 43.18,9.53 U11.P14 43.18,20.95 41.91,22.23 U4.P14
  Bottom 0.2: U2.P38 105.41,10.79 103.19,10.79 103.19,9.62 103.2,9.61 103.2,8.81 98.2,3.81 91.44,3.81 89.53,1.91 60.96,1.91 v59.05,3.81
SND1_ENABLE_N
  Bottom 0.2: ATF22V10C.20 27.25,49 25.5,49 25.5,55.5 18.75,62.25 4.75,62.25 4.13,61.63 4.13,6.03 4.72,5.44 4.81,5.44 | 4.81,5.44 9.13,1.12 47.47,1.12 48.26,1.91 U11.P5 U11.P6 | 4.81,5.44 4.75,5.5
SND1_READY
  Bottom 0.2: U11.P4 45.2,3.17 43.58,1.55 42.83,1.55 42.79,1.52 21.98,1.52 21.59,1.91 21.59,20.64 | 21.59,20.64 R2.2 | IC2.1 21.27,20.95 21.59,20.64
SND2_ENABLE_N  (via drill 0.35)
  Top 0.2: ATF22V10C.19 27.5,46.25 29.84,43.91 29.84,29.23 v29.98,29.09 | U4.P5 U4.P6
  Bottom 0.2: 38,17.75 38.03,17.71 | 38.03,17.71 39,16.75 45.25,16.75 46.75,18.25 U4.P5 | 38.03,17.71 38.03,26.85 37.23,27.66 36.43,27.66 36.08,27.3 31.77,27.3 v29.98,29.09
SND2_READY  (via drill 0.35)
  Top 0.2: IC2.2 22.23,18.41 v23.5,17.14
  Bottom 0.2: IC2.2 19.05,18.41 R6.2 | U4.P4 44.97,18.41 46.59,20.04 47.39,20.04 47.95,19.48 47.95,17.36 46.95,16.35 35.29,16.35 34.49,17.14 v23.5,17.14
SNDOUT1
  Bottom 0.2: U11.P7 55.56,5.4 C27.+
SNDOUT2
  Bottom 0.254: C1.+ 53.98,20.32 U4.P7
SYSRESET*
  Top 0.2: ATF22V10C.14 24.77,33.66 22.86,31.75 22.86,28.69 20.63,26.46 20.63,24.98 12.03,16.38 10.03,16.38 9.53,15.88 9.53,13.02 9.21,12.7 U$1.P$2
TMS9118_RW(*)_TMS4416_W(*)
  Top 0.2: U2.P11 86.75,28 84.25,30.5 84.25,38 82.75,39.5 82.75,40 U1.4
  Bottom 0.2: U3.4 99.5,40.25 98.5,41.25 83.75,41.25 82.75,40.25 U1.4
TMS9918_AD0-TMS4416_A7
  Top 0.2: 92,52.75 U3.10 91.44,52.7 88.9,50.16 88.9,30.48 89.53,29.84 U2.P10
  Bottom 0.2: U1.10 75,52.5 75.25,52.25 81.25,52.25 82,51.5 91,51.5 92,52.5 U3.10
TMS9918_AD1-TMS4416_A6  (via drill 0.35)
  Top 0.2: v97.75,34.25 98,34.5 98,43.25 99.5,44.75 99.5,45 U3.6
  Bottom 0.2: v97.75,34.25 97.75,33.5 92.25,28 U2.P9 | U1.6 82.75,45.25 83.75,46.25 98.5,46.25 99.5,45.25 U3.6
TMS9918_AD2-TMS4416_A5  (via drill 0.35)
  Top 0.2: U3.7 99.75,47.5 99.75,47.25 101.25,45.75 101.25,31.07 v100.75,30.57
  Bottom 0.2: U1.7 82.75,47.75 83.75,48.75 98.5,48.75 99.5,47.75 U3.7 | U2.P8 94.61,28.57 96.52,30.48 100.66,30.48 v100.75,30.57
TMS9918_AD3-TMS4416_A4
  Top 0.2: U3.8 99.5,50.25 97.15,47.9 97.16,47.9 97.16,35.56 96.52,34.92 96.52,28.57 U2.P7
  Bottom 0.2: U1.8 82.75,50.25 83.5,51 91.25,51 91.75,51.5 98.25,51.5 99.5,50.25 U3.8
TMS9918_AD4-TMS4416_A3  (via drill 0.35)
  Top 0.2: U3.11 92.25,50.25 94.61,47.88 94.61,40.64 95.25,40.01 95.25,36.48 v95.61,36.12
  Bottom 0.2: U1.11 75,50 76,49 83.25,49 84.25,50 92,50 U3.11 | U2.P6 102.23,30.48 102.23,33.98 102.25,34 100,36.25 95.75,36.25 v95.61,36.12
TMS9918_AD5-TMS4416_A2  (via drill 0.35)
  Top 0.2: U2.P5 102.25,28 104.5,30.25 v104.5,38
  Bottom 0.2: U1.12 75,47.5 76,46.5 83.25,46.5 84.25,47.5 92,47.5 U3.12 92.25,47.5 98,47.5 99,46.5 104.5,46.5 v104.5,38
TMS9918_AD6-TMS4416_A1  (via drill 0.35)
  Top 0.2: U2.P4 105.75,28.91 v105.75,35.75
  Bottom 0.2: U1.13 75,45 76.25,43.75 83,43.75 84.25,45 92,45 U3.13 92.25,45 98.13,45 99.31,43.81 101.6,43.81 103.5,41.91 103.5,38.1 103.82,37.79 103.82,37.72 105.75,35.79 v105.75,35.75
TMS9918_AD7-TMS4416_A0
  Bottom 0.2: U1.14 75,42.5 76.25,41.25 83,41.25 84.25,42.5 92,42.5 U3.14 92.25,42.5 98,42.5 99.25,41.25 99.28,41.27 100.97,41.27 102.23,40.01 102.23,36.51 106.68,32.07 106.68,28.51 107.31,27.88 U2.P3
TRIGGER  (via drill 0.35)
  Top 0.2: v56.75,31.5 60.75,35.5 60.75,55.5 62,56.75 62,57.75 RN1.9
  Bottom 0.2: v56.75,31.5 43.5,31.5 43.25,31.25 IC8.11 | JOYSTICK1.9 50.2,63.32 50.51,63.32 53.21,60.62 58.88,60.62 61.71,57.78 RN1.9
TRIGGER1  (via drill 0.35)
  Top 0.2: RN1.3 77.25,57.75 77.25,51.52 v77.27,51.5 | v71.12,35.56 68.9,35.56 67.94,34.61 v67.94,32.38
  Bottom 0.2: v71.12,35.56 73.66,38.1 73.75,38.1 73.75,51.25 74,51.5 v77.27,51.5 | IC1.11 66.04,30.48 v67.94,32.38
UP
  Top 0.2: IC8.2 35.56,51.95 37.18,53.58 37.18,57.58 JOYSTICK1.2
  Bottom 0.2: RN1.13 45.98,57.78 JOYSTICK1.2
UP1
  Bottom 0.2: IC1.2 55.25,51 59.25,55 64.5,55 67.25,57.75 RN1.7 67.83,57.78 69.45,59.41 71.39,59.41 JOYSTICK2.2
VCC  (via drill 0.35)
  Top 0.2: C20.1 34.25,11 33,12.25 33,26 C17.1 | v70.25,53.5 68,53.5 C14.1 | 62.75,54.93 62.75,53.5 IC1.20 | 62.75,54.93 62.75,55 | U2.P33 94.75,12.75 106.09,24.09 114.26,24.09 114.94,24.77 114.94,29.21 113.03,31.11 113.03,34.61 111.44,36.2 110.6,36.2 | 110.6,36.2 110.49,36.2 Q2.C | 62.75,54.93 62.77,54.93 v63.59,55.75 | 100.14,52.7 U3.9 C4.+ | 110.6,36.2 104.27,42.52 104.27,48.73 105.24,49.71 105.24,51.6 104.19,52.65 C4.+ | C4.+ 107.61,56.17 108.41,56.17 109.38,57.15 R7.1
  Bottom 0.2: 33,26.25 C17.1 27.34,26.04 | C16.1 94.5,9.5 58.25,9.5 57.25,8.5 40.5,8.5 38.25,10.75 U11.P16 | ATF22V10C.24 27.5,59 31.5,55 42,55 43,54 IC8.20 | v70.25,53.5 71.25,54.5 82.55,54.5 | C15.1 86.5,53.5 87,54 99.69,54 99.75,54 | C13.1 46.5,54 48.25,55.75 v63.59,55.75 | R6.1 14.61,20.32 C12.1 15.25,21 19.65,25.4 23.81,25.4 R2.1 26.99,26.04 27.34,26.04 | IC2.14 27.3,26 27.34,26.04 | REG1.P$3 114.94,63.03 114.33,62.43 114.33,61.4 114.62,61.11 R7.1
  Bottom 0.254: C16.1 U2.P33 | U4.P16 C17.1 | U11.P16 C20.1 | ATF22V10C.24 C6.1 | C13.1 IC8.20 | C14.1 IC1.20 | RN1.1 82.55,54.5 U1.9 85.72,52.7 C15.1 | U3.9 99.69,54 C21.1
VDP-RD0  (via drill 0.35)
  Top 0.2: U2.P32 92,12.75 90.75,14 90.75,30.23 90.5,30.48 v90.5,36.16
  Bottom 0.2: U1.2 89.27,34.92 v90.5,36.16
VDP-RD1  (via drill 0.35)
  Top 0.2: U2.P31 89.5,12.75 88.25,14 88.25,28.59 87.63,29.21 87.63,36.37 v87.61,36.38
  Bottom 0.2: U1.3 82.75,37.25 86.75,37.25 v87.61,36.38
VDP-RD2
  Top 0.2: U1.15 75,40 75,39.75 80.75,34 80.75,30.75 83.25,28.25 83.25,26.61 85.72,24.13 85.75,24.13 86.36,23.52 86.36,13.34 U2.P30
VDP-RD3  (via drill 0.35)
  Top 0.2: U2.P29 84.45,24.13 83.19,25.4 80.94,25.4 v80.73,25.61
  Bottom 0.2: U1.17 75,34.75 79.75,30 79.86,30 80.64,29.21 80.64,25.7 v80.73,25.61
VDP-RD4  (via drill 0.35)
  Top 0.2: U2.P28 81.92,22.16 v83.5,23.75
  Bottom 0.2: v83.5,23.75 86.5,26.75 90,26.75 90.75,27.5 90.75,29.16 91.76,30.16 92.66,30.16 97.5,35 99.5,35 U3.2
VDP-RD5  (via drill 0.35)
  Top 0.2: U2.P27 79.38,21.12 v82,23.75
  Bottom 0.2: v82,23.75 85.75,27.5 85.72,27.52 85.72,28.57 87.9,30.75 88.75,30.75 91.75,33.75 93.44,33.75 94.61,34.92 94.61,36.2 95.89,37.47 U3.3
VDP-RD6  (via drill 0.35)
  Top 0.2: U3.15 92.25,40 92.25,39.5 93.75,38 93.75,31.75 93.25,31.25 93.25,16.68 v93.32,16.61
  Bottom 0.2: v93.32,16.61 80.74,16.61 U2.P26
VDP-RD7  (via drill 0.35)
  Top 0.2: v80,30.75 78.25,29 78.25,16.5 74.5,12.75 U2.P25
  Bottom 0.2: v80,30.75 80.5,31.25 88.5,31.25 92,34.75 U3.17
VDP_MODE  (via drill 0.35)
  Top 0.2: v51.38,23.25 51.38,24.7 51.11,24.98 51.11,28.9 49.63,30.38 v49.63,34.63
  Bottom 0.2: ATF22V10C.16 27.5,38.5 27.75,38.25 34,38.25 35,37.25 47.02,37.25 v49.63,34.63 | v51.38,23.25 51.63,23.5 57.78,23.5 58.29,24 81.15,24 81.92,24.77 U2.P13
VID_RESET*  (via drill 0.35)
  Top 0.2: U2.P34 97.16,8.26 95.58,6.68 95.58,6.59 95.01,6.02 94.22,6.02 93.25,6.99 91.12,6.99 88.27,9.84 58.1,9.84 55.24,6.99 v47.62,6.99 | ATF22V10C.15 28.57,36.2 28.93,35.84 28.93,23.14 30.48,21.59 30.48,6.03 30.8,5.71 v32.38,5.71
  Bottom 0.2: v32.38,5.71 46.35,5.71 v47.62,6.99
VOLTAGE-IN
  Bottom 0.406: C5.+ 107.95,66.67
  Bottom 0.508: S1.1 19.31,66.53 19.31,66.26 20.48,65.09 23.81,65.09 23.84,65.11 27.69,65.11 33.69,71.12 103.5,71.12 107.95,66.67 107.95,66.61 109.28,67.94 REG1.P$1
WAIT*
  Top 0.2: IC2.3 13.97,10.16 6.35,10.16 5.08,11.43 5.08,62.87 5.71,63.5 7.94,63.5 9.21,62.23 9.21,58.74 9.84,58.1 9.84,53.98 10.48,53.34 U$1.P$33
XTAL1
  Bottom 0.2: Q1.1 C9.2
  Bottom 0.254: U2.P40 112.39,9.53 Q1.1

### Text on the board
tNames: +9V IN | 5V Reg | AUD 1 | AUD 2 | Lum | 74LS244 | 74LS244 | TMS4416 | TMS4416 | VID OUT | SN76489AN | TMS9918 VDP | VID IN | 74LS08 | SN76489AN | TRS-80 Model 1 / Gaming Card - V2.0 / Joe Rounceville
tValues: GND | VIN | VCC